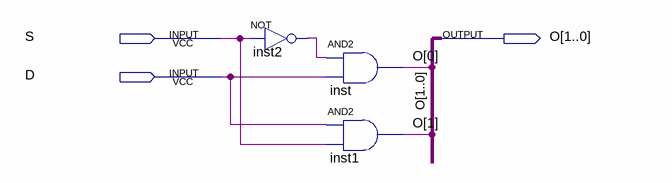
[diagram p0: schematic sheet]
// Quartus schematic DEMUX_1X2.bdf as structural Verilog: 3 symbols, 3 pins
module DEMUX_1X2 (
  input  S,
  input  D,
  output [1:0] O
);

  wire inst2_out;

  not inst2 (inst2_out, S);
  and inst (O[0], inst2_out, D);
  and inst1 (O[1], D, S);
endmodule
